# Altium schematic sheet MainMCU.SchDoc
size A3
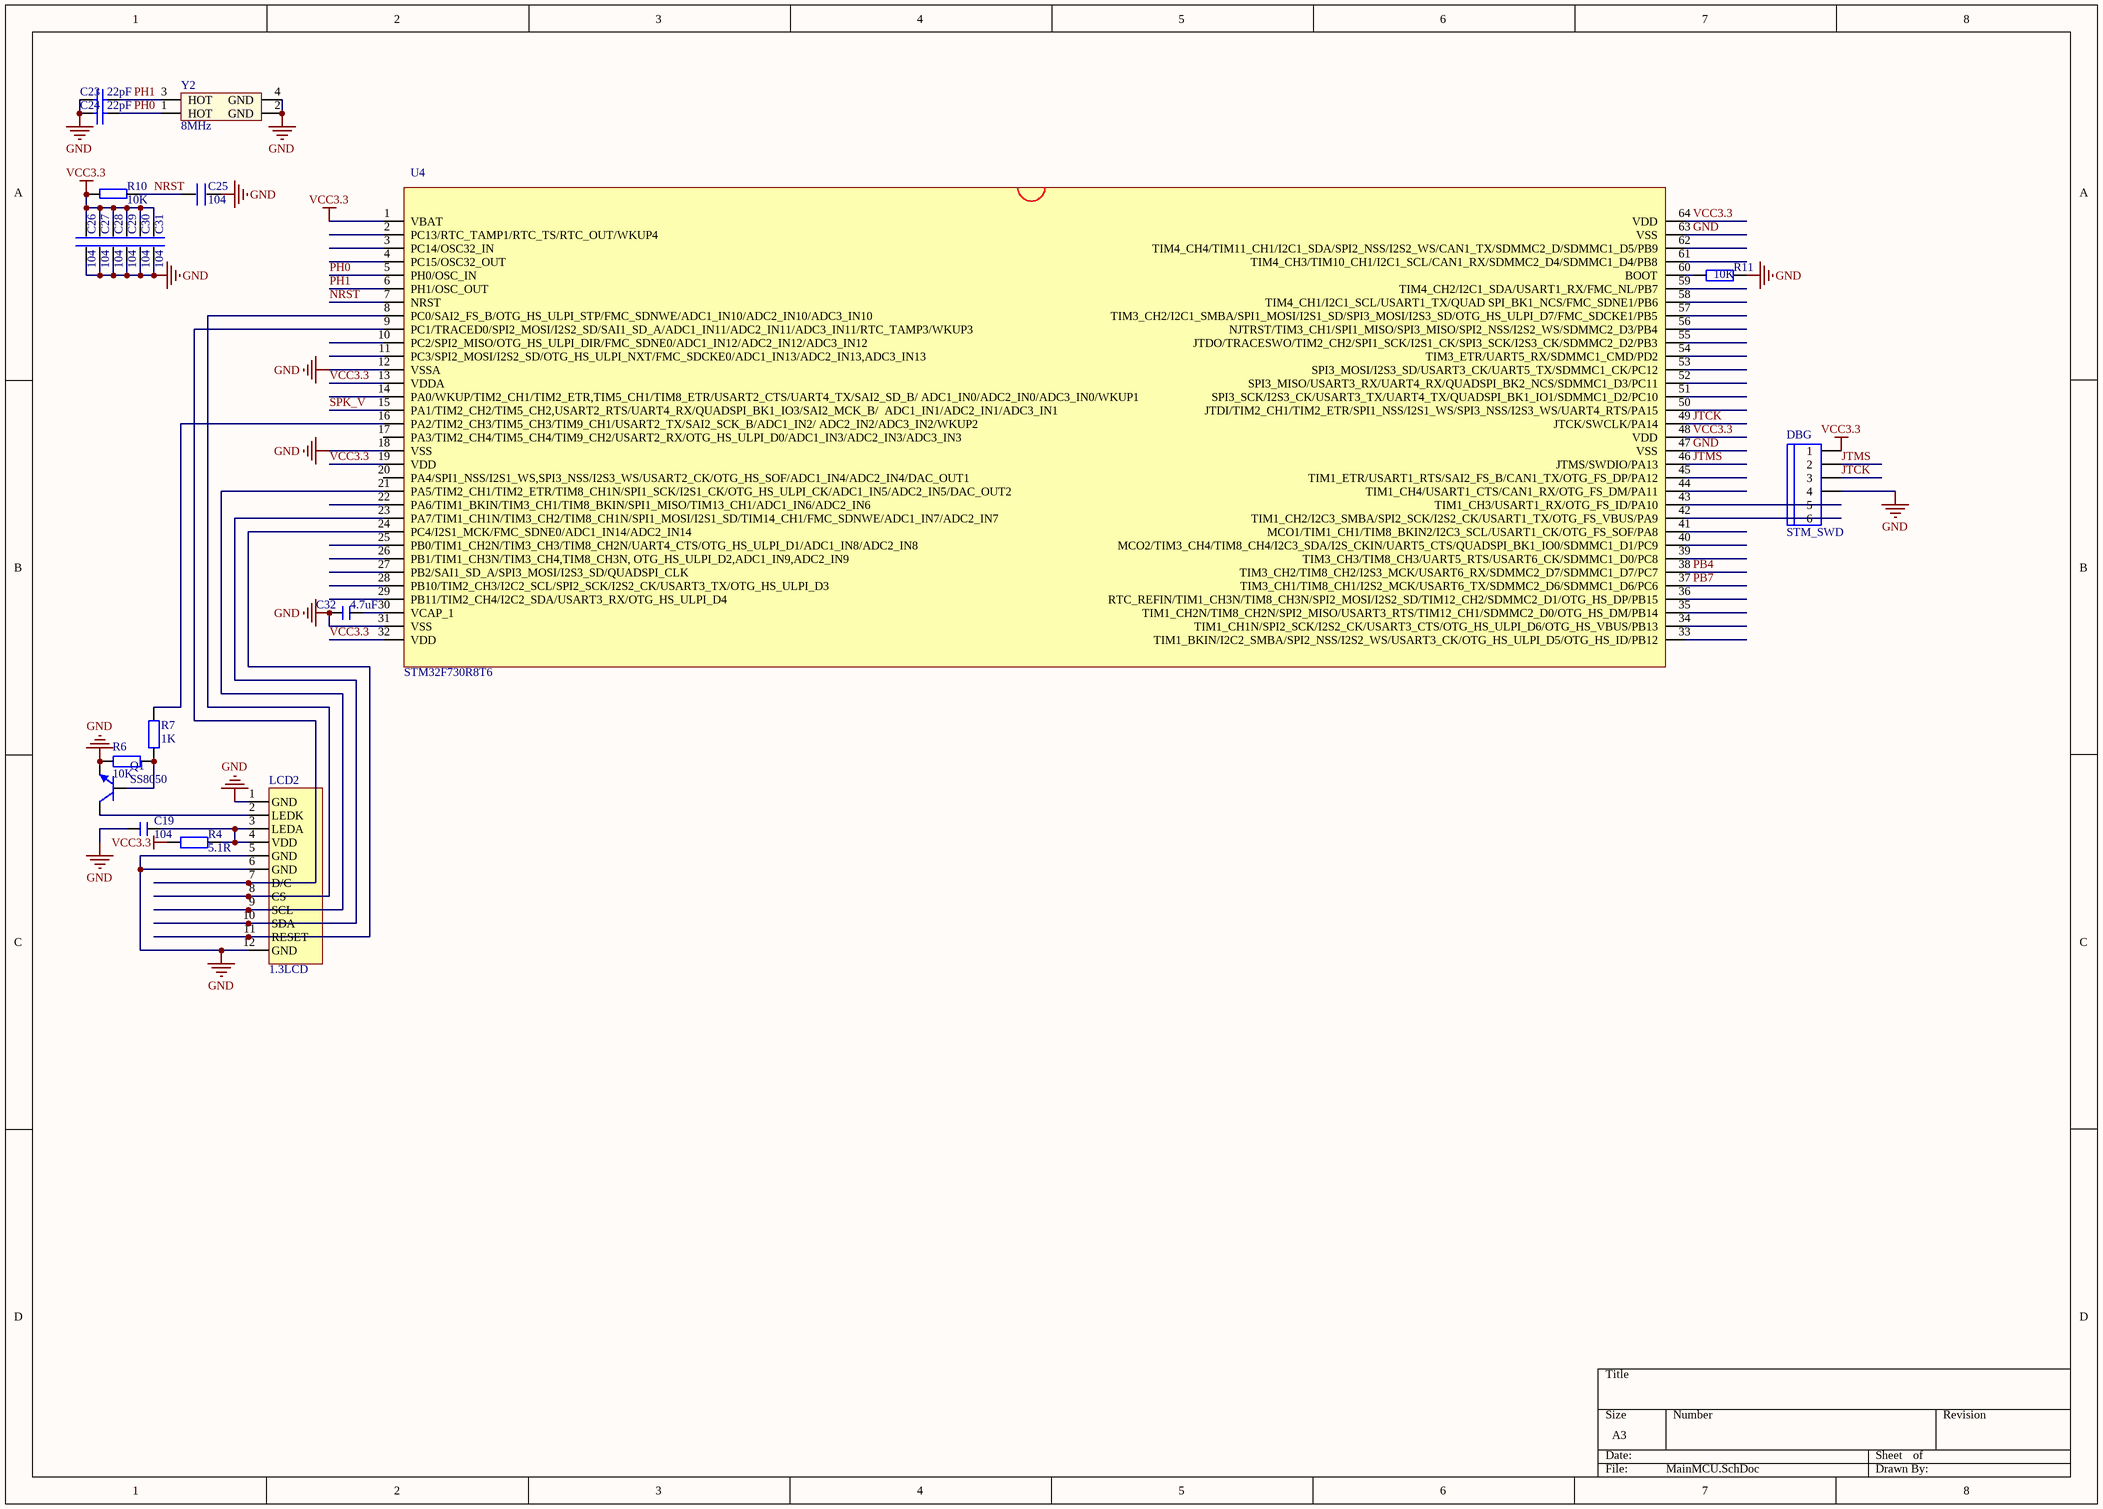
[diagram p0: MainMCU.SchDoc]

## Parts
C19  104  [C 0603_L]
C23  22pF  [C 0603_L]
C24  22pF  [C 0603_L]
C25  104  [C 0603_L]
C26  104  [C 0603_L]
C27  104  [C 0603_L]
C28  104  [C 0603_L]
C29  104  [C 0603_L]
C30  104  [C 0603_L]
C31  104  [C 0603_L]
C32  4.7uF  [C 0603_L]
DBG  STM_SWD  [SH1.0 S-W-6P]
LCD2  1.3LCD  [TFT-N133-2424THBIG01]
Q1  SS8050  [SOT23-3L]
R4  5.1R  [R 0805_L]
R6  10K  [R 0603_L]
R7  1K  [R 0603_L]
R10  10K  [R 0603_L]
R11  10K  [R 0603_L]
U4  STM32F730R8T6  [LQFP64 10x10_L]
Y2  8MHz  [OSC 3225-4P]

## Nets
GND: C19.2 C23.2 C24.2 C25.1 C26.2 C27.2 C28.2 C29.2 C30.2 C31.2 C32.1 DBG.4 LCD2.1(GND) LCD2.5(GND) LCD2.6(GND) LCD2.12(GND) Q1.2(E) R6.2 R11.1 U4.12(VSSA) U4.18(VSS) U4.31(VSS) U4.47(VSS) U4.63(VSS) Y2.2(GND) Y2.4(GND)
VCC3.3: C26.1 C27.1 C28.1 C29.1 C30.1 C31.1 DBG.1 R4.1 R10.2 U4.1(VBAT) U4.13(VDDA) U4.19(VDD) U4.32(VDD) U4.48(VDD) U4.64(VDD)
JTCK: DBG.3 U4.49(JTCK/SWCLK/PA14)
JTMS: DBG.2 U4.46(JTMS/SWDIO/PA13)
NRST: C25.2 R10.1 U4.7(NRST)
PB4: U4.38(TIM3_CH2/TIM8_CH2/I2S3_MCK/USART6_RX/SDMMC2_D7/SDMMC1_D7/PC7)
PB7: U4.37(TIM3_CH1/TIM8_CH1/I2S2_MCK/USART6_TX/SDMMC2_D6/SDMMC1_D6/PC6)
PH0: C24.1 U4.5(PH0/OSC_IN) Y2.1(HOT)
PH1: C23.1 U4.6(PH1/OSC_OUT) Y2.3(HOT)
SPK_V: U4.15(PA1/TIM2_CH2/TIM5_CH2,USART2_RTS/UART4_RX/QUADSPI_BK1_IO3/SAI2_MCK_B/__ADC1_IN1/ADC2_IN1/ADC3_IN1)
NetC19_1: C19.1 LCD2.3(LEDA) LCD2.4(VDD) R4.2
NetC32_2: C32.2 U4.30(VCAP_1)
NetDBG_5: DBG.5 U4.43(TIM1_CH3/USART1_RX/OTG_FS_ID/PA10)
NetDBG_6: DBG.6 U4.42(TIM1_CH2/I2C3_SMBA/SPI2_SCK/I2S2_CK/USART1_TX/OTG_FS_VBUS/PA9)
NetLCD2_2: LCD2.2(LEDK) Q1.3(C)
NetLCD2_7: LCD2.7(D/C) U4.9(PC1/TRACED0/SPI2_MOSI/I2S2_SD/SAI1_SD_A/ADC1_IN11/ADC2_IN11/ADC3_IN11/RTC_TAMP3/WKUP3)
NetLCD2_8: LCD2.8(CS) U4.8(PC0/SAI2_FS_B/OTG_HS_ULPI_STP/FMC_SDNWE/ADC1_IN10/ADC2_IN10/ADC3_IN10)
NetLCD2_9: LCD2.9(SCL) U4.21(PA5/TIM2_CH1/TIM2_ETR/TIM8_CH1N/SPI1_SCK/I2S1_CK/OTG_HS_ULPI_CK/ADC1_IN5/ADC2_IN5/DAC_OUT2)
NetLCD2_10: LCD2.10(SDA) U4.23(PA7/TIM1_CH1N/TIM3_CH2/TIM8_CH1N/SPI1_MOSI/I2S1_SD/TIM14_CH1/FMC_SDNWE/ADC1_IN7/ADC2_IN7)
NetLCD2_11: LCD2.11(RESET) U4.24(PC4/I2S1_MCK/FMC_SDNE0/ADC1_IN14/ADC2_IN14)
NetQ1_1: Q1.1(B) R6.1 R7.2
NetR7_1: R7.1 U4.16(PA2/TIM2_CH3/TIM5_CH3/TIM9_CH1/USART2_TX/SAI2_SCK_B/ADC1_IN2/_ADC2_IN2/ADC3_IN2/WKUP2)
NetR11_2: R11.2 U4.60(BOOT)

Not connected (* = marked no-connect by the designer): U4 2(PC13/RTC_TAMP1/RTC_TS/RTC_OUT/WKUP4) 3(PC14/OSC32_IN) 4(PC15/OSC32_OUT) 10(PC2/SPI2_MISO/OTG_HS_ULPI_DIR/FMC_SDNE0/ADC1_IN12/ADC2_IN12/ADC3_IN12) 11(PC3/SPI2_MOSI/I2S2_SD/OTG_HS_ULPI_NXT/FMC_SDCKE0/ADC1_IN13/ADC2_IN13,ADC3_IN13) 14(PA0/WKUP/TIM2_CH1/TIM2_ETR,TIM5_CH1/TIM8_ETR/USART2_CTS/UART4_TX/SAI2_SD_B/_ADC1_IN0/ADC2_IN0/ADC3_IN0/WKUP1) 17(PA3/TIM2_CH4/TIM5_CH4/TIM9_CH2/USART2_RX/OTG_HS_ULPI_D0/ADC1_IN3/ADC2_IN3/ADC3_IN3) 20(PA4/SPI1_NSS/I2S1_WS,SPI3_NSS/I2S3_WS/USART2_CK/OTG_HS_SOF/ADC1_IN4/ADC2_IN4/DAC_OUT1) 22(PA6/TIM1_BKIN/TIM3_CH1/TIM8_BKIN/SPI1_MISO/TIM13_CH1/ADC1_IN6/ADC2_IN6) 25(PB0/TIM1_CH2N/TIM3_CH3/TIM8_CH2N/UART4_CTS/OTG_HS_ULPI_D1/ADC1_IN8/ADC2_IN8) 26(PB1/TIM1_CH3N/TIM3_CH4,TIM8_CH3N,_OTG_HS_ULPI_D2,ADC1_IN9,ADC2_IN9) 27(PB2/SAI1_SD_A/SPI3_MOSI/I2S3_SD/QUADSPI_CLK) 28(PB10/TIM2_CH3/I2C2_SCL/SPI2_SCK/I2S2_CK/USART3_TX/OTG_HS_ULPI_D3) 29(PB11/TIM2_CH4/I2C2_SDA/USART3_RX/OTG_HS_ULPI_D4) 33(TIM1_BKIN/I2C2_SMBA/SPI2_NSS/I2S2_WS/USART3_CK/OTG_HS_ULPI_D5/OTG_HS_ID/PB12) 34(TIM1_CH1N/SPI2_SCK/I2S2_CK/USART3_CTS/OTG_HS_ULPI_D6/OTG_HS_VBUS/PB13) 35(TIM1_CH2N/TIM8_CH2N/SPI2_MISO/USART3_RTS/TIM12_CH1/SDMMC2_D0/OTG_HS_DM/PB14) 36(RTC_REFIN/TIM1_CH3N/TIM8_CH3N/SPI2_MOSI/I2S2_SD/TIM12_CH2/SDMMC2_D1/OTG_HS_DP/PB15) 39(TIM3_CH3/TIM8_CH3/UART5_RTS/USART6_CK/SDMMC1_D0/PC8) 40(MCO2/TIM3_CH4/TIM8_CH4/I2C3_SDA/I2S_CKIN/UART5_CTS/QUADSPI_BK1_IO0/SDMMC1_D1/PC9) 41(MCO1/TIM1_CH1/TIM8_BKIN2/I2C3_SCL/USART1_CK/OTG_FS_SOF/PA8) 44(TIM1_CH4/USART1_CTS/CAN1_RX/OTG_FS_DM/PA11) 45(TIM1_ETR/USART1_RTS/SAI2_FS_B/CAN1_TX/OTG_FS_DP/PA12) 50(JTDI/TIM2_CH1/TIM2_ETR/SPI1_NSS/I2S1_WS/SPI3_NSS/I2S3_WS/UART4_RTS/PA15) 51(SPI3_SCK/I2S3_CK/USART3_TX/UART4_TX/QUADSPI_BK1_IO1/SDMMC1_D2/PC10) 52(SPI3_MISO/USART3_RX/UART4_RX/QUADSPI_BK2_NCS/SDMMC1_D3/PC11) 53(SPI3_MOSI/I2S3_SD/USART3_CK/UART5_TX/SDMMC1_CK/PC12) 54(TIM3_ETR/UART5_RX/SDMMC1_CMD/PD2) 55(JTDO/TRACESWO/TIM2_CH2/SPI1_SCK/I2S1_CK/SPI3_SCK/I2S3_CK/SDMMC2_D2/PB3) 56(NJTRST/TIM3_CH1/SPI1_MISO/SPI3_MISO/SPI2_NSS/I2S2_WS/SDMMC2_D3/PB4) 57(TIM3_CH2/I2C1_SMBA/SPI1_MOSI/I2S1_SD/SPI3_MOSI/I2S3_SD/OTG_HS_ULPI_D7/FMC_SDCKE1/PB5) 58(TIM4_CH1/I2C1_SCL/USART1_TX/QUAD_SPI_BK1_NCS/FMC_SDNE1/PB6) 59(TIM4_CH2/I2C1_SDA/USART1_RX/FMC_NL/PB7) 61(TIM4_CH3/TIM10_CH1/I2C1_SCL/CAN1_RX/SDMMC2_D4/SDMMC1_D4/PB8) 62(TIM4_CH4/TIM11_CH1/I2C1_SDA/SPI2_NSS/I2S2_WS/CAN1_TX/SDMMC2_D/SDMMC1_D5/PB9)

## Library data of the parts
C19 = C: 无极性电容; BOM名称: 无极性贴片电容; 版权归属: 正点原子; 学习资源: www.openedv.com
C23 C24 = CAP
C25-C31 = C
C32 = C: 无极性贴片电容; 版权归属: 源创客; BOM名称: 无极性贴片电容; 学习资源: www.ooocke.com
DBG = HEAD6
LCD2 = TFTLCD-N133-2424THBIG01: TFTLCD,240*240,SPI
Q1 = 8050-SMD: 高频放大-NPN型; 版权归属: 正点原子; 属性: 40V 1.5A 1W 100MHZ; Parameter: 三极管; BOM名称: 高频放大-NPN型; 学习资源: www.openedv.com
R4 R6 R7 = R: 贴片电阻
R10 = R
R11 = R: 贴片电阻; 版权归属: 源创客; BOM名称: 贴片电阻; 学习资源: www.ooocke.com
U4 = STM32F730R8T6: STM32 M7内核
Y2 = Y-3225-4P: 晶振25MHz; Published: 8-Jun-2000; LatestRevisionDate: 17-Jul-2002; LatestRevisionNote: Re-released for DXP Platform.; Publisher: Altium Limited